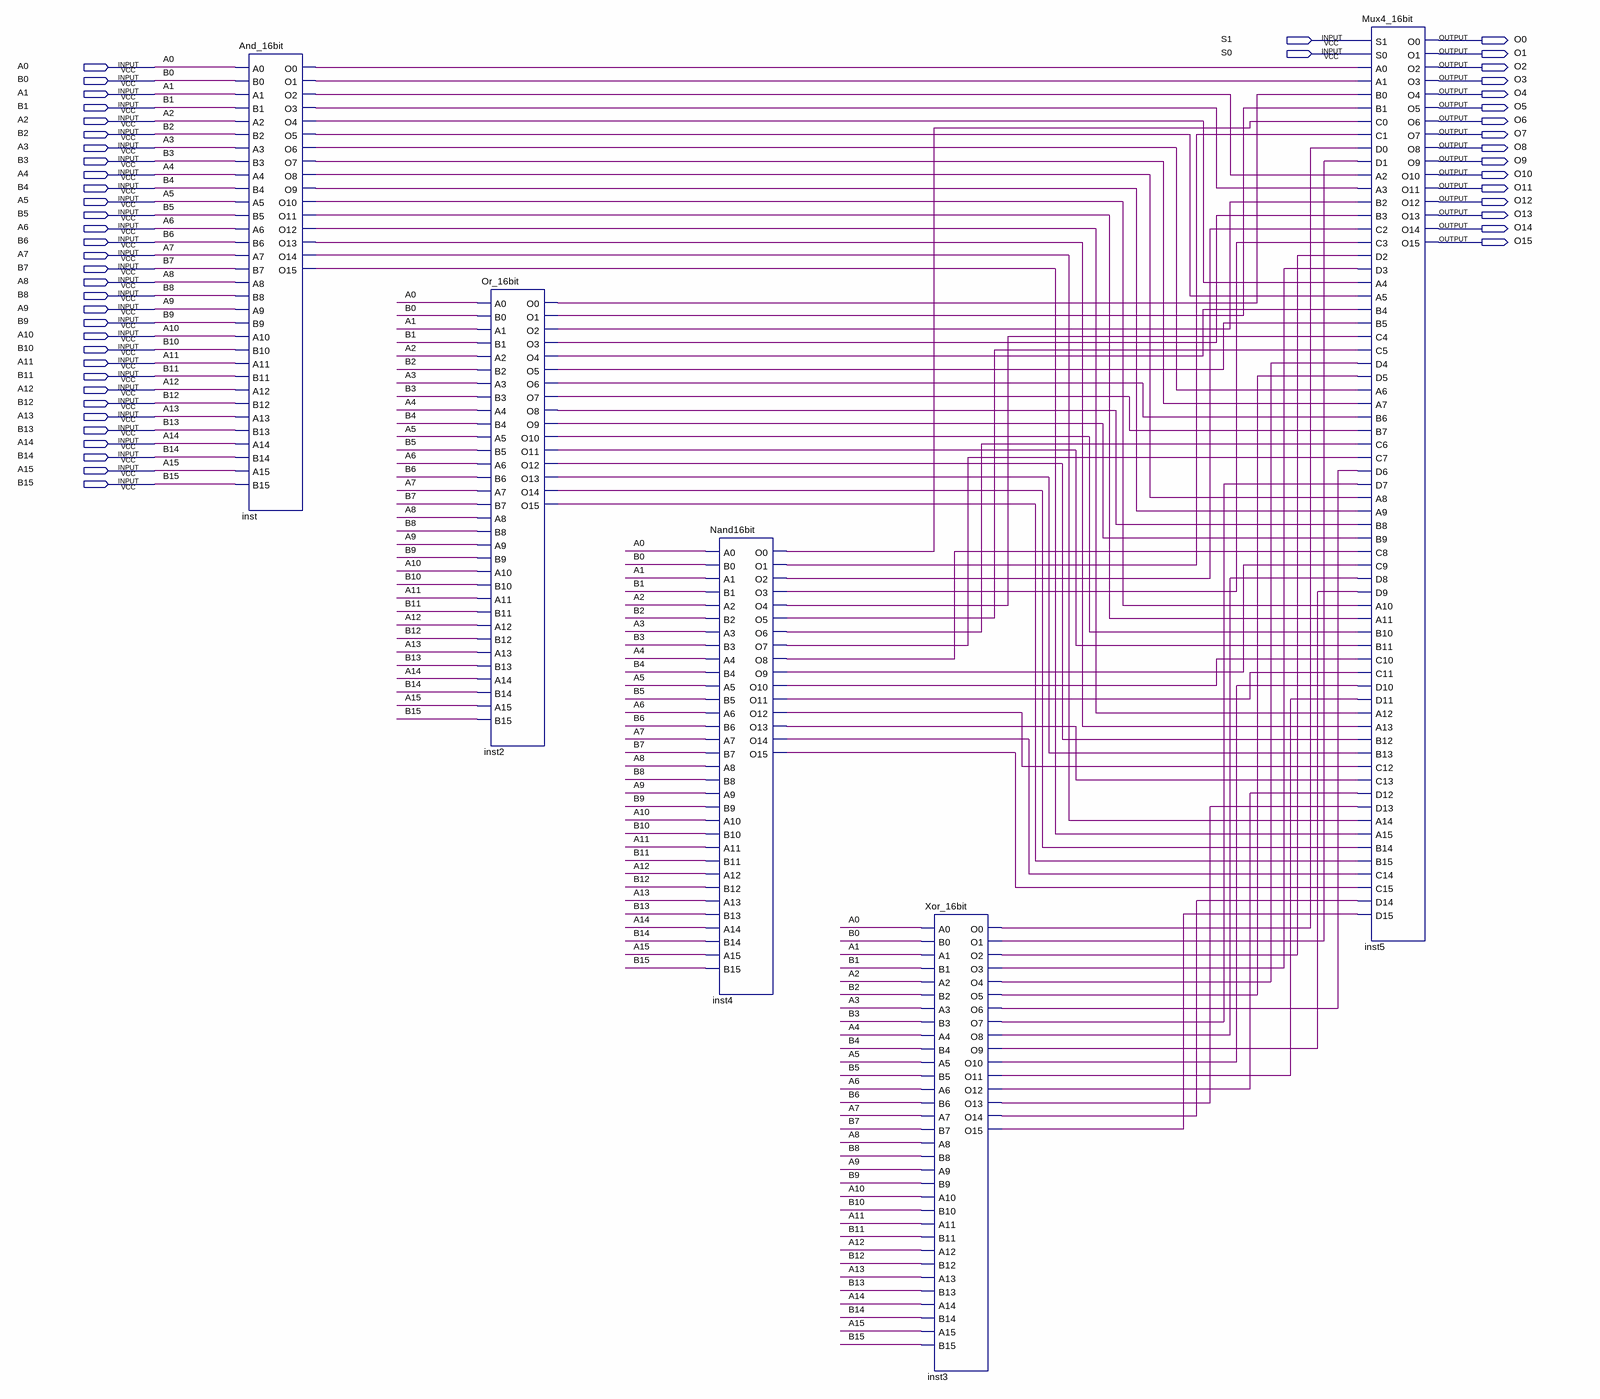
[diagram p0: schematic sheet]
// Quartus schematic LU_16BIT_Design.bdf as structural Verilog: 5 symbols, 50 pins
module LU_16BIT_Design (
  input  S1,
  input  S0,
  input  A0,
  input  B0,
  input  A1,
  input  B1,
  input  A2,
  input  B2,
  input  A3,
  input  B3,
  input  A4,
  input  B4,
  input  A5,
  input  B5,
  input  A6,
  input  B6,
  input  A7,
  input  B7,
  input  A8,
  input  B8,
  input  A9,
  input  B9,
  input  A10,
  input  B10,
  input  A11,
  input  B11,
  input  A12,
  input  B12,
  input  A13,
  input  B13,
  input  A14,
  input  B14,
  input  A15,
  input  B15,
  output O0,
  output O1,
  output O2,
  output O3,
  output O4,
  output O5,
  output O6,
  output O7,
  output O8,
  output O9,
  output O10,
  output O11,
  output O12,
  output O13,
  output O14,
  output O15
);

  wire inst2_o0, inst2_o1, inst2_o2, inst2_o3, inst2_o4, inst2_o5, inst2_o6, inst2_o7, inst2_o8, inst2_o9,
       inst2_o10, inst2_o11, inst2_o12, inst2_o13, inst2_o14, inst2_o15, inst3_o0, inst3_o1, inst3_o2,
       inst3_o3, inst3_o4, inst3_o5, inst3_o6, inst3_o7, inst3_o8, inst3_o9, inst3_o10, inst3_o11, inst3_o12,
       inst3_o13, inst3_o14, inst3_o15, inst4_o0, inst4_o1, inst4_o2, inst4_o3, inst4_o4, inst4_o5, inst4_o6,
       inst4_o7, inst4_o8, inst4_o9, inst4_o10, inst4_o11, inst4_o12, inst4_o13, inst4_o14, inst4_o15,
       inst_o0, inst_o1, inst_o2, inst_o3, inst_o4, inst_o5, inst_o6, inst_o7, inst_o8, inst_o9, inst_o10,
       inst_o11, inst_o12, inst_o13, inst_o14, inst_o15;

  And_16bit inst (
    .A0(A0), .B0(B0), .A1(A1), .B1(B1), .A2(A2), .B2(B2), .A3(A3), .B3(B3), .A4(A4), .B4(B4), .A5(A5),
    .B5(B5), .A6(A6), .B6(B6), .A7(A7), .B7(B7), .A8(A8), .B8(B8), .A9(A9), .B9(B9), .A10(A10), .B10(B10),
    .A11(A11), .B11(B11), .A12(A12), .B12(B12), .A13(A13), .B13(B13), .A14(A14), .B14(B14), .A15(A15),
    .B15(B15), .O0(inst_o0), .O1(inst_o1), .O2(inst_o2), .O3(inst_o3), .O4(inst_o4), .O5(inst_o5),
    .O6(inst_o6), .O7(inst_o7), .O8(inst_o8), .O9(inst_o9), .O10(inst_o10), .O11(inst_o11), .O12(inst_o12),
    .O13(inst_o13), .O14(inst_o14), .O15(inst_o15));
  Or_16bit inst2 (
    .A0(A0), .B0(B0), .A1(A1), .B1(B1), .A2(A2), .B2(B2), .A3(A3), .B3(B3), .A4(A4), .B4(B4), .A5(A5),
    .B5(B5), .A6(A6), .B6(B6), .A7(A7), .B7(B7), .A8(A8), .B8(B8), .A9(A9), .B9(B9), .A10(A10), .B10(B10),
    .A11(A11), .B11(B11), .A12(A12), .B12(B12), .A13(A13), .B13(B13), .A14(A14), .B14(B14), .A15(A15),
    .B15(B15), .O0(inst2_o0), .O1(inst2_o1), .O2(inst2_o2), .O3(inst2_o3), .O4(inst2_o4), .O5(inst2_o5),
    .O6(inst2_o6), .O7(inst2_o7), .O8(inst2_o8), .O9(inst2_o9), .O10(inst2_o10), .O11(inst2_o11),
    .O12(inst2_o12), .O13(inst2_o13), .O14(inst2_o14), .O15(inst2_o15));
  Nand16bit inst4 (
    .A0(A0), .B0(B0), .A1(A1), .B1(B1), .A2(A2), .B2(B2), .A3(A3), .B3(B3), .A4(A4), .B4(B4), .A5(A5),
    .B5(B5), .A6(A6), .B6(B6), .A7(A7), .B7(B7), .A8(A8), .B8(B8), .A9(A9), .B9(B9), .A10(A10), .B10(B10),
    .A11(A11), .B11(B11), .A12(A12), .B12(B12), .A13(A13), .B13(B13), .A14(A14), .B14(B14), .A15(A15),
    .B15(B15), .O0(inst4_o0), .O1(inst4_o1), .O2(inst4_o2), .O3(inst4_o3), .O4(inst4_o4), .O5(inst4_o5),
    .O6(inst4_o6), .O7(inst4_o7), .O8(inst4_o8), .O9(inst4_o9), .O10(inst4_o10), .O11(inst4_o11),
    .O12(inst4_o12), .O13(inst4_o13), .O14(inst4_o14), .O15(inst4_o15));
  Xor_16bit inst3 (
    .A0(A0), .B0(B0), .A1(A1), .B1(B1), .A2(A2), .B2(B2), .A3(A3), .B3(B3), .A4(A4), .B4(B4), .A5(A5),
    .B5(B5), .A6(A6), .B6(B6), .A7(A7), .B7(B7), .A8(A8), .B8(B8), .A9(A9), .B9(B9), .A10(A10), .B10(B10),
    .A11(A11), .B11(B11), .A12(A12), .B12(B12), .A13(A13), .B13(B13), .A14(A14), .B14(B14), .A15(A15),
    .B15(B15), .O0(inst3_o0), .O1(inst3_o1), .O2(inst3_o2), .O3(inst3_o3), .O4(inst3_o4), .O5(inst3_o5),
    .O6(inst3_o6), .O7(inst3_o7), .O8(inst3_o8), .O9(inst3_o9), .O10(inst3_o10), .O11(inst3_o11),
    .O12(inst3_o12), .O13(inst3_o13), .O14(inst3_o14), .O15(inst3_o15));
  Mux4_16bit inst5 (
    .S1(S1), .S0(S0), .A0(inst_o0), .A1(inst_o1), .B0(inst2_o0), .B1(inst2_o1), .C0(inst4_o0), .C1(inst4_o1),
    .D0(inst3_o0), .D1(inst3_o1), .A2(inst_o2), .A3(inst_o3), .B2(inst2_o2), .B3(inst2_o3), .C2(inst4_o2),
    .C3(inst4_o3), .D2(inst3_o2), .D3(inst3_o3), .A4(inst_o4), .A5(inst_o5), .B4(inst2_o4), .B5(inst2_o5),
    .C4(inst4_o4), .C5(inst4_o5), .D4(inst3_o4), .D5(inst3_o5), .A6(inst_o6), .A7(inst_o7), .B6(inst2_o6),
    .B7(inst2_o7), .C6(inst4_o6), .C7(inst4_o7), .D6(inst3_o6), .D7(inst3_o7), .A8(inst_o8), .A9(inst_o9),
    .B8(inst2_o8), .B9(inst2_o9), .C8(inst4_o8), .C9(inst4_o9), .D8(inst3_o8), .D9(inst3_o9), .A10(inst_o10),
    .A11(inst_o11), .B10(inst2_o10), .B11(inst2_o11), .C10(inst4_o10), .C11(inst4_o11), .D10(inst3_o10),
    .D11(inst3_o11), .A12(inst_o12), .A13(inst_o13), .B12(inst2_o12), .B13(inst2_o13), .C12(inst4_o12),
    .C13(inst4_o13), .D12(inst3_o12), .D13(inst3_o13), .A14(inst_o14), .A15(inst_o15), .B14(inst2_o14),
    .B15(inst2_o15), .C14(inst4_o14), .C15(inst4_o15), .D14(inst3_o14), .D15(inst3_o15), .O0(O0), .O1(O1),
    .O2(O2), .O3(O3), .O4(O4), .O5(O5), .O6(O6), .O7(O7), .O8(O8), .O9(O9), .O10(O10), .O11(O11), .O12(O12),
    .O13(O13), .O14(O14), .O15(O15));
endmodule
